# Altium schematic sheet Connectors.SchDoc
size A4; DocumentNumber: 3; SheetNumber: 3; SheetTotal: 4
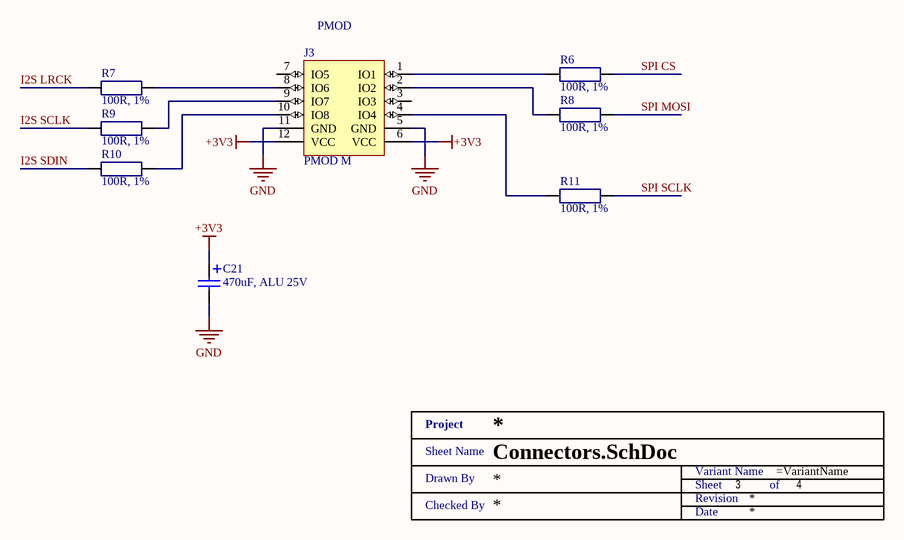
[diagram p0: Connectors.SchDoc]

## Parts
C21  470uF, ALU 25V  [WCAP-ATG8_8x11.5x3.5]
J3  PMOD M  [PMOD M]
R6  100R, 1%  [SMD0402 - R]
R7  100R, 1%  [SMD0402 - R]
R8  100R, 1%  [SMD0402 - R]
R9  100R, 1%  [SMD0402 - R]
R10  100R, 1%  [SMD0402 - R]
R11  100R, 1%  [SMD0402 - R]
XX?  Title 1  (value not drawn)  (graphical)

## Nets
+3V3: C21.1 J3.6(VCC) J3.12(VCC)
GND: C21.2 J3.5(GND) J3.11(GND)
I2S LRCK: R7.1
I2S SCLK: R9.1
I2S SDIN: R10.1
SPI CS: R6.2
SPI MOSI: R8.2
SPI SCLK: R11.2
NetJ3_1: J3.1(IO1) R6.1
NetJ3_2: J3.2(IO2) R8.1
NetJ3_4: J3.4(IO4) R11.1
NetJ3_8: J3.8(IO6) R7.2
NetJ3_9: J3.9(IO7) R9.2
NetJ3_10: J3.10(IO8) R10.2

Not connected (* = marked no-connect by the designer): J3 3(IO3) 7(IO5)

## Notes on the sheet
- (near J3) PMOD
- (in symbol Title 1) Project; Sheet Name; Variant Name; Drawn By; Sheet; of; Revision; Checked By; Date

## Library data of the parts
C21 = 860010474013: WURTH ELEKTRONIK - 860010474013 - CAP, ALU ELEC, 470UF, 25V, RADIAL; Capacitance: 470u; Product Range: WCAP-ATG8 Series; Capacitance Tolerance: ± 20%; Capacitor Terminals: Radial Leaded; Lifetime @ Temperature: 2000 hours @ 85; SVHC: No SVHC (07-Jul-2017); Supplier 1: Farnell; Supplier Part Number 1: 2465681; Manufacturer: WURTH ELEKTRONIK; Manufacturer Part Number: 860010474013; RoHS: YES; Stock 1: 134; Pricing 1: 1=0.313, 3=0.282, 5=0.257, 10=0.232, 20=0.23, 50=0.189, 250=0.18 (GBP); Voltage Rating: 25V; Diameter: 8; Lead Spacing: 3.5; Height: 11.5; Operating Temperature Min: -40; Operating Temperature Max: 85; ESR: -; Automotive Qualification Standard: -; RoHS Phthalates Compliant: Yes; MSL: MSL 1 - Unlimited; Packaging: Each<!--FANDB--><div class="features-and-benefits-container"><div class="features-and-benefits-desc-container"><span class="features-and-benefits-container-desc">Electrolytic Capacitor, 470 µF, 25 V, WCAP-ATG8 Series, ± 20%, Radial Leaded, 8 mm</span></div></div>; ComponentLink1URL: http://www.farnell.com/datasheets/1879524.pdf; ComponentLink1Description: http://www.farnell.com/datasheets/1879524.pdf; Supplier 2: Digi-Key; Supplier Part Number 2: 732-8636-1-ND; Supplier 3: Mouser; Supplier Part Number 3: 710-860010474013
J3 = PMOD M: WR-PHD 2.54 mm THT Angled Dual Pin Header, 12 pins; Manufacturer: Wurth Electronics; Manufacturer Part Number: 61301221021; Number of Positions: 12; Gender: Male; Connector Type: Male Pin; Pitch: 0.1inch; Supplier 1: Mouser; Supplier Part Number 1: 710-61301221021; RoHS: Yes; Category: Connectors; Pricing 1: 1=0.94000, 10=0.79300, 50=0.55100, 100=0.50100, 1000=0.45500, 10000=0.45500 (USD); Mount: Through Hole; Contact Plating: Gold; Contact Material: Copper; Color: Black; Number of Rows: 2; Packaging: Bulk; Termination: Solder; Number of Contacts: 12; Row Spacing: 0.1inch; Contact Mating Length: 0.236inch; REACH SVHC: Unknown; RoHS Compliant: Yes; ComponentLink1URL: https://katalog.we-online.de/em/datasheet/6130xx21021.pdf?src-supplier=Digi-Key; ComponentLink1Description: https://katalog.we-online.de/em/datasheet/6130xx21021.pdf?src-supplier=Digi-Key; ComponentLink2URL: http://www.farnell.com/cad/1737270.pdf?src-supplier=Element14; ComponentLink2Description: http://www.farnell.com/cad/1737270.pdf?src-supplier=Element14; Supplier 2: Farnell; Supplier Part Number 2: 2356197; Supplier 3: Digi-Key; Supplier Part Number 3: 732-5354-ND; Supplier 4: RSComponents; Supplier Part Number 4: 8281711
R6-R11 = RC0402FR-07100RL: YAGEO - RC0402FR-07100RL - RES, 100R, 1%, 0.0625W, 0402, THICK FILM; Resistor Case Style: 0402 [1005 Metric]; Resistance: 100; Product Range: RC Series; Voltage Rating: 50; Power Rating: 62.5; Temperature Coefficient: ± 100; SVHC: No SVHC (27-Jun-2018); Reel Quantity: 10000<!--FANDB--><div class="features-and-benefits-container"><div class="features-and-benefits-desc-container"><span class="features-and-benefits-container-desc">SMD Chip Resistor, 0402 [1005 Metric], 100 ohm, RC Series, 50 V, Thick Film, 62.5 mW</span></div><div class="features-and-benefits-description"><span class="features-benefits-value">The Yageo RC_L series resistors are general purpose thick film chip resistors with lead free terminations made by thick film process. The resistance range includes E24 and E96 decade values from 1ohm to 100Mohm. These resistors are constructed on top of a high grade ceramic body.</span></div><div class="features-and-benefits-list"><ul class="features-and-benefits-list-list"><li class="features-and-benefits-list-item">EIA 0075, 0100, 0201, 0402, 0603, 0805, 1206, 1210, 1218, 2010, 2512 case sizes available</li><li class="features-and-benefits-list-item">Small chip sizes save PCB space</li><li class="features-and-benefits-list-item">Rated voltage range of 10V to 200V</li><li class="features-and-benefits-list-item">Maximum power rating of 2W</li><li class="features-and-benefits-list-item">Available in ±0.1%, ±0.5%, ±1% and ±5% tolerance</li><li class="features-and-benefits-list-item">High component and equipment reliability</li><li class="features-and-benefits-list-item">Forbidden materials are not used in products/production</li><li class="features-and-benefits-list-item">-55°C to 155°C temperature range for RC0402 to RC2512 and -55°C to 125°C for RC0075 to RC0201; Supplier 1: Farnell; Supplier Part Number 1: 9239111; Manufacturer: YAGEO; Manufacturer Part Number: RC0402FR-07100RL; RoHS: YES; Stock 1: 260492; Pricing 1: 10=0.385, 100=0.38, 500=0.285, 2500=0.144, 5000=0.121 (EUR); Resistor Element Material: Thick Film; Resistance Tolerance: ± 1%; Automotive Qualification Standard: -; MSL: MSL 1 - Unlimited; Operating Temperature Max: 155; Operating Temperature Min: -55; ComponentLink1URL: http://www.farnell.com/datasheets/2167052.pdf; ComponentLink1Description: http://www.farnell.com/datasheets/2167052.pdf; Supplier 2: Mouser; Supplier Part Number 2: 603-RC0402FR-07100RL